# Altium project Fußplatte.PrjPcb
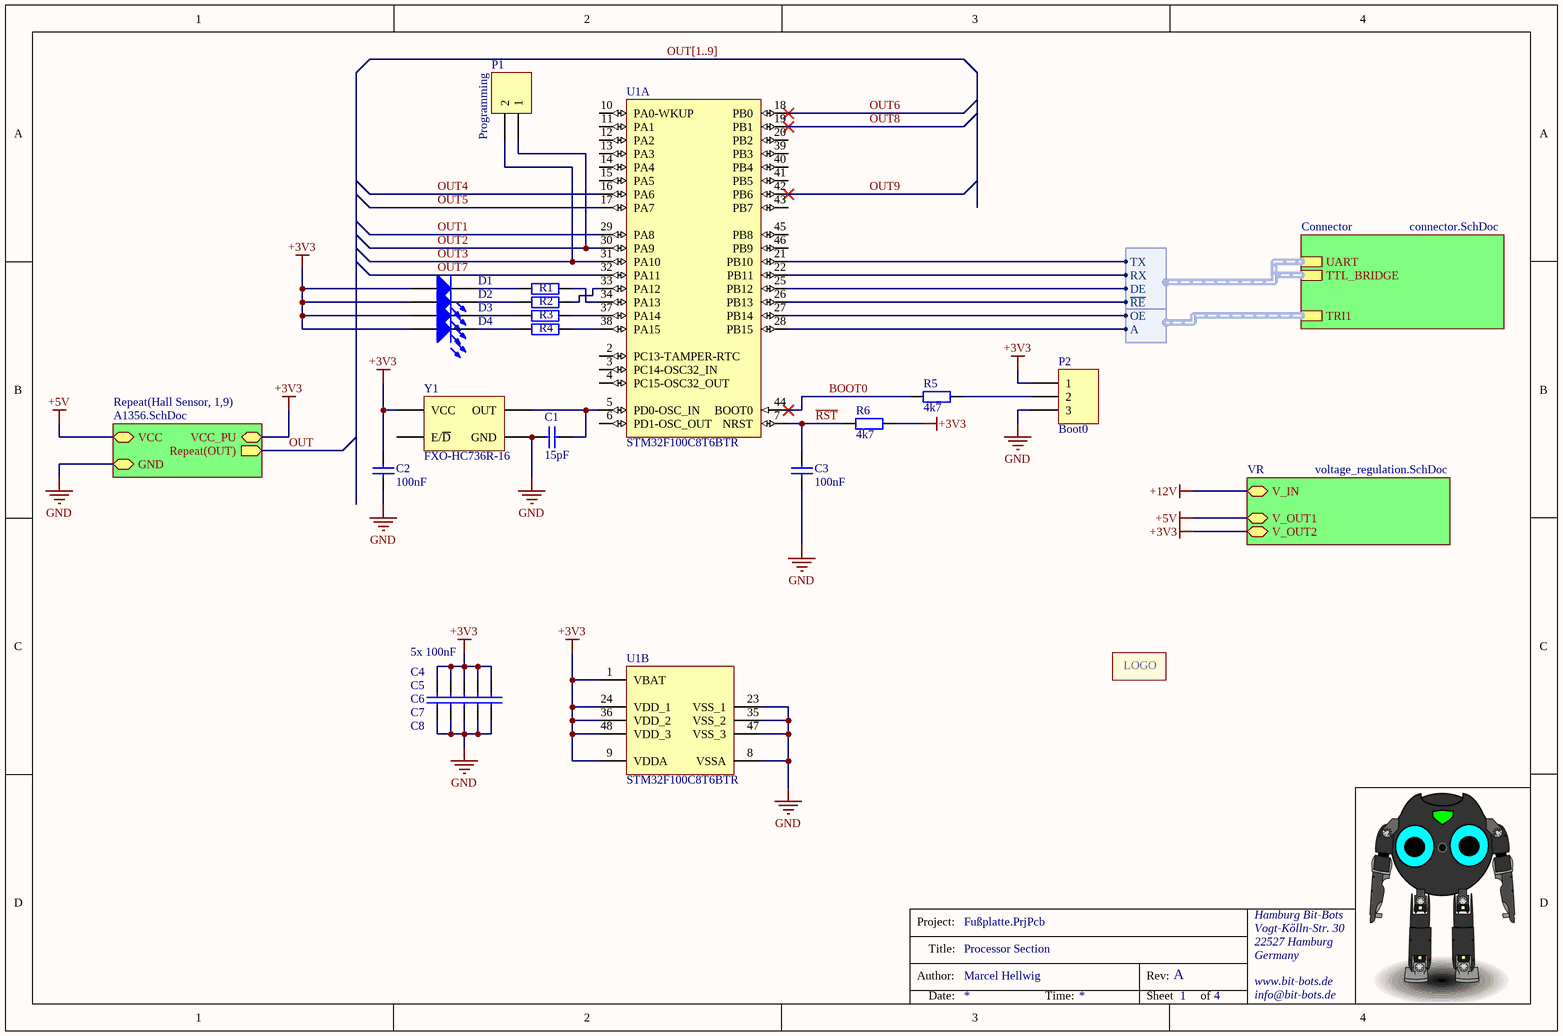
[diagram p0: mainsheet.SchDoc]
ProjectRevision: A
4 sheets, 55 parts. Net scope: hierarchical (ports join the sheet entries above them; power ports are global).
Board files: foot_left.PcbDoc, foot_right.PcbDoc, panelized.PcbDoc
Sheets:
  mainsheet.SchDoc
    Hall Sensor1 = A1356.SchDoc
    Hall Sensor2 = A1356.SchDoc
    Hall Sensor3 = A1356.SchDoc
    Hall Sensor4 = A1356.SchDoc
    Hall Sensor5 = A1356.SchDoc
    Hall Sensor6 = A1356.SchDoc
    Hall Sensor7 = A1356.SchDoc
    Hall Sensor8 = A1356.SchDoc
    Hall Sensor9 = A1356.SchDoc
    Connector = connector.SchDoc
    VR = voltage_regulation.SchDoc

## Sheet mainsheet.SchDoc: Processor Section
size A4; Author: Marcel Hellwig; Organization: Hamburg Bit-Bots; Address1: Vogt-Kölln-Str. 30; Address2: 22527 Hamburg; Address3: Germany; Address4: www.bit-bots.de; DocumentNumber: 1; SheetNumber: 1; SheetTotal: 4; EMail: info@bit-bots.de

### Parts
C1  15pF  [C2012]
C2  100nF  [C2012]
C3  100nF  [C2012]
C4  100nF  [C2012]  (value not drawn)
C5  100nF  [C2012]  (value not drawn)
C6  100nF  [C2012]  (value not drawn)
C7  100nF  [C2012]  (value not drawn)
C8  100nF  [C2012]  (value not drawn)
D1  Green  [MLCC2]  (value not drawn)
D2  Green  [MLCC2]  (value not drawn)
D3  Green  [MLCC2]  (value not drawn)
D4  Green  [MLCC2]  (value not drawn)
Logo1  Hamburg Bit-Bots Logo  [Logo]  (value not drawn)  (no BOM)
P1  Programming  [HDR1X2]  (no BOM)
P2  Boot0  [HDR1X3]  (no BOM)
R1  1k  [R2012]  (value not drawn)
R2  1k  [R2012]  (value not drawn)
R3  1k  [R2012]  (value not drawn)
R4  1k  [R2012]  (value not drawn)
R5  4k7  [R2012]
R6  4k7  [R2012]
U1  STM32F100C8T6BTR  [STM-LQFP48_L]  (parts A,B of 2)
Y1  FXO-HC736R-16  [FXO-HC73]

### Sub-sheets
Connector = connector.SchDoc: UART (harness UART), TTL_BRIDGE (harness UART), TRI1 (harness Tri-State)
Repeat(Hall Sensor, 1,9) = A1356.SchDoc: VCC, GND, Repeat(OUT) (out), VCC_PU
VR = voltage_regulation.SchDoc: V_OUT1, V_OUT2, V_IN

### Harnesses
Tri-State: A, OE
UART: ~{RE}, DE, RX, TX

### Nets
+3V3: C2.1 C4.2 C5.2 C6.2 C7.2 C8.2 D1.1(A) D2.1(A) D3.1(A) D4.1(A) P2.1 R6.2 U1.1(VBAT) U1.9(VDDA) U1.24(VDD_1) U1.36(VDD_2) U1.48(VDD_3) Y1.4(VCC) ; sheet Repeat(Hall Sensor, 1,9)/VCC_PU, sheet VR/V_OUT2
+5V: sheet Repeat(Hall Sensor, 1,9)/VCC, sheet VR/V_OUT1
GND: C1.1 C2.2 C3.1 C4.1 C5.1 C6.1 C7.1 C8.1 P2.3 U1.8(VSSA) U1.23(VSS_1) U1.35(VSS_2) U1.47(VSS_3) Y1.2(GND) ; sheet Repeat(Hall Sensor, 1,9)/GND
~{RST}: C3.2 R6.1 U1.7(NRST)
BOOT0: R5.1 U1.44(BOOT0)
OUT: sheet Repeat(Hall Sensor, 1,9)/Repeat(OUT)
OUT1: U1.29(PA8)
OUT2: P1.1 U1.30(PA9)
OUT3: P1.2 U1.31(PA10)
OUT4: U1.16(PA6)
OUT5: U1.17(PA7)
OUT6: U1.18(PB0)
OUT7: U1.32(PA11)
OUT8: U1.19(PB1)
OUT9: U1.42(PB6)
NetC1_2: C1.2 U1.5(PD0-OSC_IN) Y1.3(OUT)
NetD1_2: D1.2(K) R1.2
NetD2_2: D2.2(K) R2.2
NetD3_2: D3.2(K) R3.2
NetD4_2: D4.2(K) R4.2
NetIC1_2: U1.26(PB13) ; sheet Connector/UART.~{RE}
NetP2_2: P2.2 R5.2
NetR1_1: R1.1 U1.34(PA13)
NetR2_1: R2.1 U1.33(PA12)
NetR3_1: R3.1 U1.37(PA14)
NetR4_1: R4.1 U1.38(PA15)
NetTR1_2: U1.22(PB11) ; sheet Connector/UART.RX
NetTR1_4: U1.25(PB12) ; sheet Connector/UART.DE
NetTR1_5: U1.21(PB10) ; sheet Connector/UART.TX
NetU1_27: U1.27(PB14) ; sheet Connector/TRI1.OE
NetU1_28: U1.28(PB15) ; sheet Connector/TRI1.A

Not connected (* = marked no-connect by the designer): U1 2(PC13-TAMPER-RTC) 3(PC14-OSC32_IN) 4(PC15-OSC32_OUT) 6(PD1-OSC_OUT) 10(PA0-WKUP) 11(PA1) 12(PA2) 13(PA3) 14(PA4) 15(PA5) 20(PB2) 39(PB3) 40(PB4) 41(PB5) 43(PB7) 45(PB8) 46(PB9); Y1 1(E/~{D})

### Buses and harness runs
bus OUT[1..9]
harness sheet Connector/TTL_BRIDGE = sheet Connector/UART

### Notes on the sheet
- 5x 100nF
- Project:
- Author:
- Title:
- Rev:
- Date:
- Time:
- Sheet
- of
- (in symbol Logo) LOGO

### Library data of the parts
C1 = Cap: Capacitor; Manufacturer: MULTICOMP; Manufacturer Part Number: MC0805N150J500CT; Produktpalette: Baureihe MC; Kapazität: 15; Kapazitätstoleranz: ±5%; Dielektrikum: C0G / NP0; Nennspannung: 50; Keramikkondensatorgehäuse: 0805 [Metrisch 2012]; Betriebstemperatur, min.: -55; Betriebstemperatur, max.: 125; Verpackung: Gurtabschnitt; SVHC: No SVHC (17-Dec-2014); Betriebstemperatur: -55°C bis +125; Kondensatoranschlüsse: SMD<!--FANDB--><div class="features-and-benefits-container"></div>; Published: 8-Jun-2000; LatestRevisionDate: 17-Jul-2002; LatestRevisionNote: Re-released for DXP Platform.; PackageReference: RAD-0.3; Publisher: Altium Limited; PackageDescription: Radial Cap, Thru-Hole; 2 Leads; 0.3 in Pin Spacing; Value: 15pF; Supplier 1: Farnell; Supplier Part Number 1: 1759193; RoHS: YES; Stock 1: 38433; Pricing 1: 10=0,021, 100=0,017, 500=0,014, 1000=0,012, 2000=0,009 (EUR); MSL: -; Bauform: 0805 [Metrisch 2012]; Kapazitätstoleranz ±: ±5%; ComponentLink1URL: http://www.farnell.com/datasheets/1870456.pdf; ComponentLink1Description: http://www.farnell.com/datasheets/1870456.pdf
C2-C8 = Cap: Capacitor; Published: 8-Jun-2000; LatestRevisionDate: 17-Jul-2002; LatestRevisionNote: Re-released for DXP Platform.; PackageReference: RAD-0.3; Publisher: Altium Limited; PackageDescription: Radial Cap, Thru-Hole; 2 Leads; 0.3 in Pin Spacing; Value: 100nF
  C2: Supplier 1: Farnell; Supplier Part Number 1: 1759265
D1-D4 = LED0: Typical INFRARED GaAs LED; Manufacturer: VISHAY; Manufacturer Part Number: VLMC3100-GS08; Leuchtengröße: 2.4; LED-Farbe: Grün; Lichtstärke: 1.6; Abstrahlwinkel: 120°; Durchlassstrom If: 2; Durchlassspannung: 1.9; LED-Montage: Oberflächenmontage; Linsenform: Rund; Wellenlänge, typ.: 575; Verpackung: Gurtabschnitt; SVHC: No SVHC (16-Jun-2014); Betriebstemperatur: -40°C bis +100; Betriebstemperatur, max.: 100; Betriebstemperatur, min.: -40; LED-Typ: Standard; LED/Lampen Größe: PLCC-2; Montage: SMD; Sperrspannung: 6; Spitzenwellenlänge: 565; Winkel halber Empfindlichkeit ±: 60; Published: 8-Jun-2000; LatestRevisionDate: 08-Jul-2005; LatestRevisionNote: Mech Layer 1 removed.; PackageReference: LED-0; Publisher: Altium Limited; PackageDescription: LED; 2 Leads; Supplier 1: Farnell; Supplier Part Number 1: 1659076; RoHS: YES; Stock 1: 12975; Pricing 1: 5=0,105, 25=0,0998, 100=0,0952, 250=0,0917, 500=0,0865, 2000=0,0771, 4000=0,0717, 20000=0,0689 (EUR); MSL: MSL 2A - 4 Wochen; Anzahl der Pins: 2; Dominante Wellenlänge: 575; Durchlassspannung Vf max.: 2.4; Durchlassstrom If, max.: 2; Lichtstärke, typ.: 1.6; ComponentLink1URL: http://www.farnell.com/datasheets/1698102.pdf; ComponentLink1Description: http://www.farnell.com/datasheets/1698102.pdf
Logo1 = Logo
P1 = Header 2: Header, 2-Pin; LatestRevisionDate: 17-Jul-2002; LatestRevisionNote: Re-released for DXP Platform.; Publisher: Altium Limited
P2 = Header 3: Header, 3-Pin; LatestRevisionDate: 17-Jul-2002; LatestRevisionNote: Re-released for DXP Platform.; Publisher: Altium Limited
R1-R4 = Res2: Resistor; Manufacturer: MULTICOMP; Manufacturer Part Number: MC01W0805110K; Published: 8-Jun-2000; LatestRevisionDate: 17-Jul-2002; LatestRevisionNote: Re-released for DXP Platform.; PackageReference: AXIAL-0.4; Publisher: Altium Limited; PackageDescription: Axial Device, Thru-Hole; 2 Leads; 0.4 in Pin Spacing; Value: 1k; Supplier 1: Farnell; Supplier Part Number 1: 9332391; RoHS: Y-EX; Stock 1: 4370; Pricing 1: 50=0,038, 250=0,031, 1000=0,022, 5000=0,014, 15000=0,009 (EUR); ComponentLink1URL: http://www.farnell.com/datasheets/1729047.pdf; ComponentLink1Description: http://www.farnell.com/datasheets/1729047.pdf; ComponentLink2URL: http://www.farnell.com/cad/1561156.zip; ComponentLink2Description: http://www.farnell.com/cad/1561156.zip
R5 R6 = Res2: Resistor; Published: 8-Jun-2000; LatestRevisionDate: 17-Jul-2002; LatestRevisionNote: Re-released for DXP Platform.; PackageReference: AXIAL-0.4; Publisher: Altium Limited; PackageDescription: Axial Device, Thru-Hole; 2 Leads; 0.4 in Pin Spacing; Value: 4k7
U1 = CMP-0237-00141-3: ARM Cortex-M3 32-bit MCU, 64 KB Flash, 8 KB Internal RAM, 37 I/Os, 48-pin LQFP, -40 to 85 degC, Tape and Reel; D/A Converter: 2x12-bit (2 Channel); I/Os (High Current): 37; A/D Converter: 1x12-bit (10 Channel); FLASH Size (Prog) (kB): 64; Operating Frequency(F) (Processor speed) (MHz): 24; Internal RAM Size (kB): 8; Supply Voltage(Vcc) min (V): 2; ComponentLink2Description: Datasheet; ComponentLink3Description: Package Specification; Packing: Tape and Reel; Core: ARM Cortex-M3; DatasheetVersion: Rev. 7; Mounting Technology: Surface Mount; ComponentLink3URL: http://www.st.com/st-web-ui/static/active/en/resource/technical/document/datasheet/DM00058181.pdf; PackageVersion: Rev. 6, 06/2013; PackageReference: LQFP48; ComponentLink1Description: Manufacturer URL; PartNumber: STM32F100C8T6BTR; ComponentLink1URL: http://www.st.com/web/en/home.html; PackageDescription: 48-Pin Low Profile Quad Flat Package, 7 x 7 mm Body, 0.5 mm Pitch; ComponentLink2URL: http://www.st.com/st-web-ui/static/active/en/resource/technical/document/datasheet/CD00251732.pdf; PartId: 1
Y1 = Oszillator: Oscillator with Enable Input; Supplier 1: Farnell; Supplier Part Number 1: 1640997

## Sheet A1356.SchDoc: Hall Sensor
size A4; Author: Marcel Hellwig; Organization: Hamburg Bit-Bots; Address1: Vogt-Kölln-Str. 30; Address2: 22527 Hamburg; Address3: Germany; Address4: www.bit-bots.de; DocumentNumber: 3; SheetNumber: 3; SheetTotal: 4; EMail: info@bit-bots.de
Used 9 times, as channels Hall Sensor1, Hall Sensor2, Hall Sensor3, Hall Sensor4, Hall Sensor5, Hall Sensor6, Hall Sensor7, Hall Sensor8, Hall Sensor9. Parts and nets are listed once, with the designators drawn on the sheet.
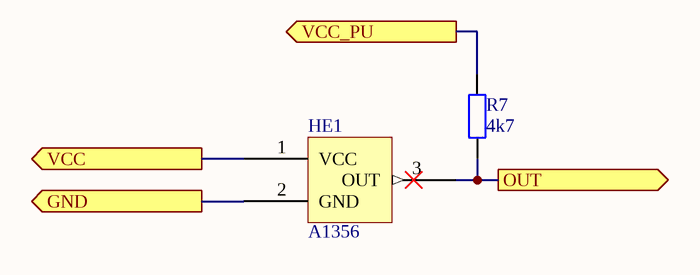
[diagram p1: A1356.SchDoc]

### Parts
HE1  A1356  [3-Pin SIP]
R7  4k7  [R2012]

### Ports
GND, OUT (out), VCC, VCC_PU

### Nets
GND: HE1.2(GND) ; port GND
OUT: HE1.3(OUT) R7.1 ; port OUT
VCC: HE1.1(VCC) ; port VCC
VCC_PU: R7.2 ; port VCC_PU

### Channels
Hall Sensor1: designators end in _1; ports GND=GND OUT=OUT1 VCC=+5V VCC_PU=+3V3
Hall Sensor2: designators end in _2; ports GND=GND OUT=OUT2 VCC=+5V VCC_PU=+3V3
Hall Sensor3: designators end in _3; ports GND=GND OUT=OUT3 VCC=+5V VCC_PU=+3V3
Hall Sensor4: designators end in _4; ports GND=GND OUT=OUT4 VCC=+5V VCC_PU=+3V3
Hall Sensor5: designators end in _5; ports GND=GND OUT=OUT5 VCC=+5V VCC_PU=+3V3
Hall Sensor6: designators end in _6; ports GND=GND OUT=OUT6 VCC=+5V VCC_PU=+3V3
Hall Sensor7: designators end in _7; ports GND=GND OUT=OUT7 VCC=+5V VCC_PU=+3V3
Hall Sensor8: designators end in _8; ports GND=GND OUT=OUT8 VCC=+5V VCC_PU=+3V3
Hall Sensor9: designators end in _9; ports GND=GND OUT=OUT9 VCC=+5V VCC_PU=+3V3

### Notes on the sheet
- Project:
- Author:
- Title:
- Rev:
- Date:
- Time:
- Sheet
- of

### Library data of the parts
HE1 = A1356: Linear Hall-Effect Sensor
R7 = Res2: Resistor; Published: 8-Jun-2000; LatestRevisionDate: 17-Jul-2002; LatestRevisionNote: Re-released for DXP Platform.; PackageReference: AXIAL-0.4; Publisher: Altium Limited; PackageDescription: Axial Device, Thru-Hole; 2 Leads; 0.4 in Pin Spacing; Value: 4k7

## Sheet connector.SchDoc: Communication Section
size A4; Author: Marcel Hellwig; Organization: Hamburg Bit-Bots; Address1: Vogt-Kölln-Str. 30; Address2: 22527 Hamburg; Address3: Germany; Address4: www.bit-bots.de; DocumentNumber: 2; SheetNumber: 2; SheetTotal: 4; EMail: info@bit-bots.de
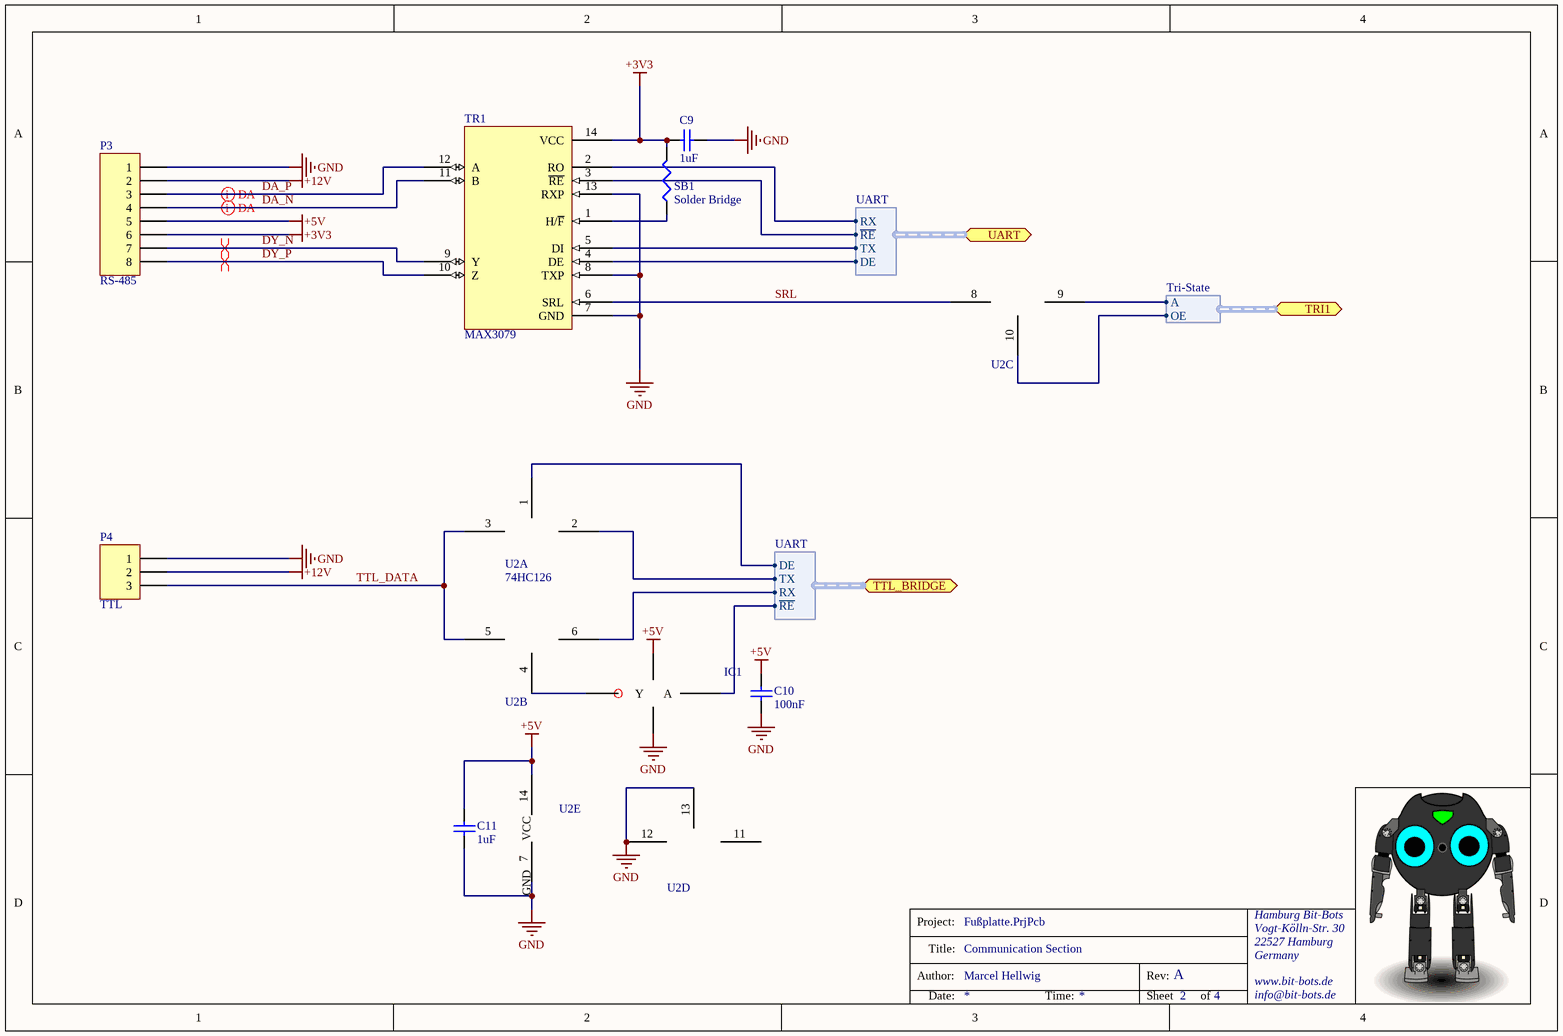
[diagram p2: connector.SchDoc]

### Parts
C9  1uF  [C2012]
C10  100nF  [C2012]
C11  1uF  [C2012]
IC1  74AHC1G04  [SOT-353]  (value not drawn)
P3  RS-485  [8-Pin]
P4  TTL  [3-Pin]
SB1  Solder Bridge  [J1-0603]  (no BOM)
TR1  MAX3079  [SOIC14]
U2  74HC126  [SOIC14]  (parts A,B,C,D,E of 5)

### Ports
TRI1 (harness Tri-State), TTL_BRIDGE (harness UART), UART (harness UART)

### Harnesses
UART: ~{RE}, DE, RX, TX
Tri-State: A, OE

### Nets
+3V3: C9.1 P3.6 SB1.2 TR1.14(VCC)
+5V: C10.2 C11.1 IC1.5(VCC) P3.5 U2.14(VCC)
+12V: P3.2 P4.2
GND: C9.2 C10.1 C11.2 IC1.3(GND) P3.1 P4.1 TR1.7(GND) TR1.8(TXP) TR1.13(RXP) U2.7(GND) U2.12(A4) U2.13(OE4)
DA_N: P3.4 TR1.11(B)
DA_P: P3.3 TR1.12(A)
DY_N: P3.7 TR1.9(Y)
DY_P: P3.8 TR1.10(Z)
SRL: TR1.6(SRL) U2.8(Y3)
TTL_DATA: P4.3 U2.3(Y1) U2.5(A2)
NetIC1_2: IC1.2(A) TR1.3(~{RE}) ; port UART.~{RE}
NetIC1_4: IC1.4(Y) U2.4(OE2)
NetSB1_1: SB1.1 TR1.1(H/~{F})
NetTR1_2: TR1.2(RO) U2.6(Y2) ; port UART.RX
NetTR1_4: TR1.4(DE) U2.1(OE1) ; port UART.DE
NetTR1_5: TR1.5(DI) U2.2(A1) ; port UART.TX
NetU1_27: U2.10(OE3) ; port TRI1.OE
NetU1_28: U2.9(A3) ; port TRI1.A

Not connected (* = marked no-connect by the designer): U2 11(Y4)

### Layout directives
differential pair: DA_N, DA_P, DY_N, DY_P

### Notes on the sheet
- Project:
- Author:
- Title:
- Rev:
- Date:
- Time:
- Sheet
- of

### Library data of the parts
C9 = Cap Semi: Capacitor; Published: 8-Jun-2000; LatestRevisionDate: 29-May-2009; LatestRevisionNote: IPC-7351 Footprint Added.; PackageReference: C1206; Publisher: Altium Limited; PackageDescription: Chip Capacitor; Value: 1uF
C10 = Cap: Capacitor; Published: 8-Jun-2000; LatestRevisionDate: 17-Jul-2002; LatestRevisionNote: Re-released for DXP Platform.; PackageReference: RAD-0.3; Publisher: Altium Limited; PackageDescription: Radial Cap, Thru-Hole; 2 Leads; 0.3 in Pin Spacing; Value: 100nF
C11 = Cap: Capacitor; Manufacturer: MULTICOMP; Manufacturer Part Number: MC0805B105K250CT; Produktpalette: Baureihe MC; Kapazität: 1; Kapazitätstoleranz: ±10%; Dielektrikum: X7; Nennspannung: 25; Keramikkondensatorgehäuse: 0805 [Metrisch 2012]; Betriebstemperatur, min.: -55; Betriebstemperatur, max.: 125; Verpackung: Gurtabschnitt; Kondensatoranschlüsse: SMD<!--FANDB--><div class="features-and-benefits-container"></div>; Published: 8-Jun-2000; LatestRevisionDate: 17-Jul-2002; LatestRevisionNote: Re-released for DXP Platform.; PackageReference: RAD-0.3; Publisher: Altium Limited; PackageDescription: Radial Cap, Thru-Hole; 2 Leads; 0.3 in Pin Spacing; Value: 1uF; Supplier 1: Farnell; Supplier Part Number 1: 2320827; RoHS: YES; Stock 1: 4031; Pricing 1: 10=0,06, 100=0,05, 500=0,041, 1000=0,034, 1500=0,027 (EUR); MSL: MSL 1 - unbegrenzt; Bauform: 0805 [Metrisch 2012]; Kapazitätstoleranz ±: ±10%; ComponentLink1URL: http://www.farnell.com/datasheets/1870456.pdf; ComponentLink1Description: http://www.farnell.com/datasheets/1870456.pdf
IC1 = 74AHC1G04: Single Logic Inverter; Supplier 1: Farnell; Supplier Part Number 1: 1085239
P3 = Header 8: Header, 8-Pin; LatestRevisionDate: 17-Jul-2002; LatestRevisionNote: Re-released for DXP Platform.; Publisher: Altium Limited
P4 = Header 3: Header, 3-Pin; LatestRevisionDate: 17-Jul-2002; LatestRevisionNote: Re-released for DXP Platform.; Publisher: Altium Limited
SB1 = Res3: Resistor; Value: 1K; Published: 8-Jun-2000; LatestRevisionDate: 29-May-2009; LatestRevisionNote: IPC-7351 Footprint Added.; PackageReference: J1-0603; Publisher: Altium Limited; PackageDescription: Chip Resistor
TR1 = MAX3079: MAX3079 RS485-Transreceiver; Supplier 1: Farnell
U2 = 74HC126: Quad 3-State Noninverting Buffer; Manufacturer: NXP; Manufacturer Part Number: 74HC126D; Supplier 1: Farnell; Supplier Part Number 1: 1085233; RoHS: YES; Stock 1: 198; Pricing 1: 1=0,444, 10=0,311, 100=0,214, 200=0,193, 500=0,173, 2000=0,155, 5000=0,0826, 20000=0,0733 (EUR); ComponentLink1URL: http://www.farnell.com/datasheets/1852048.pdf; ComponentLink1Description: http://www.farnell.com/datasheets/1852048.pdf; ComponentLink2URL: http://www.farnell.com/cad/1638396.zip; ComponentLink2Description: http://www.farnell.com/cad/1638396.zip

## Sheet voltage_regulation.SchDoc: Voltage Regulation
size A4; Author: Marcel Hellwig; Organization: Hamburg Bit-Bots; Address1: Vogt-Kölln-Str. 30; Address2: 22527 Hamburg; Address3: Germany; Address4: www.bit-bots.de; DocumentNumber: 4; SheetNumber: 4; SheetTotal: 4; EMail: info@bit-bots.de
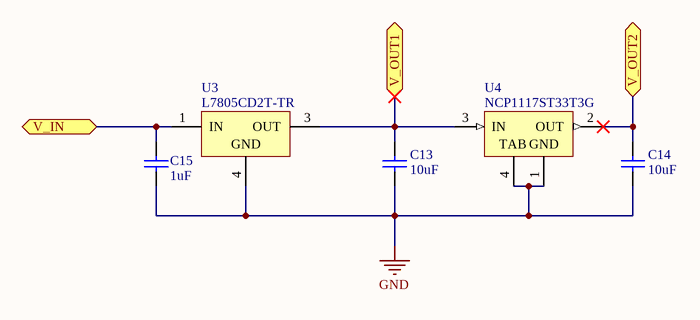
[diagram p3: voltage_regulation.SchDoc]

### Parts
C13  10uF  [C2012]
C14  10uF  [C2012]
C15  1uF  [C2012]
U3  L7805CD2T-TR  [TO-263_M]
U4  NCP1117ST33T3G  [ONSC-SOT-223_L]

### Ports
V_IN, V_OUT1, V_OUT2

### Nets
+3V3: C14.2 U4.2(OUT) ; port V_OUT2
+5V: C13.2 U3.3(OUT) U4.3(IN) ; port V_OUT1
+12V: C15.1 U3.1(IN) ; port V_IN
GND: C13.1 C14.1 C15.2 U3.4(GND) U4.1(GND) U4.4(TAB)

### Notes on the sheet
- Project:
- Author:
- Title:
- Rev:
- Date:
- Time:
- Sheet
- of

### Library data of the parts
C13 C14 = Cap: Capacitor; Manufacturer: MULTICOMP; Manufacturer Part Number: MC0805X106K250CT; Produktpalette: Baureihe MC; Kapazität: 10; Kapazitätstoleranz: ±10%; Dielektrikum: X5; Nennspannung: 25; Keramikkondensatorgehäuse: 0805 [Metrisch 2012]; Betriebstemperatur, min.: -55; Betriebstemperatur, max.: 85; Verpackung: Gurtabschnitt; Kondensatoranschlüsse: SMD<!--FANDB--><div class="features-and-benefits-container"></div>; Published: 8-Jun-2000; LatestRevisionDate: 17-Jul-2002; LatestRevisionNote: Re-released for DXP Platform.; PackageReference: RAD-0.3; Publisher: Altium Limited; PackageDescription: Radial Cap, Thru-Hole; 2 Leads; 0.3 in Pin Spacing; Value: 10uF; Supplier 1: Farnell; Supplier Part Number 1: 2320833; RoHS: YES; Stock 1: 46180; Pricing 1: 10=0,147, 100=0,121, 500=0,1, 1000=0,083, 1500=0,066 (EUR); MSL: MSL 1 - unbegrenzt; Bauform: 0805 [Metrisch 2012]; Kapazitätstoleranz ±: ±10%; ComponentLink1URL: http://www.farnell.com/datasheets/1870456.pdf; ComponentLink1Description: http://www.farnell.com/datasheets/1870456.pdf
C15 = Cap: as C11 on sheet connector; Published: 8-Jun-2000; LatestRevisionDate: 17-Jul-2002; LatestRevisionNote: Re-released for DXP Platform.; PackageReference: RAD-0.3; Publisher: Altium Limited; PackageDescription: Radial Cap, Thru-Hole; 2 Leads; 0.3 in Pin Spacing; Value: 1uF; Supplier 1: Farnell; Supplier Part Number 1: 2320827; RoHS: YES; Stock 1: 4031; Pricing 1: 10=0,06, 100=0,05, 500=0,041, 1000=0,034, 1500=0,027 (EUR); MSL: MSL 1 - unbegrenzt; Bauform: 0805 [Metrisch 2012]; Kapazitätstoleranz ±: ±10%; ComponentLink1URL: http://www.farnell.com/datasheets/1870456.pdf; ComponentLink1Description: http://www.farnell.com/datasheets/1870456.pdf
U3 = CMP-0244-00213-1: Positive Voltage Regulator, 3-Pin D2PAK, Tape and Reel; PackageReference: TO-263; ComponentLink2URL: http://www.st.com/internet/com/TECHNICAL_RESOURCES/TECHNICAL_LITERATURE/DATASHEET/CD00000444.pdf; PackageDescription: 3-Pin Transistor Outline Package 2.54 mm Pitch, 15.4 mm Lead Span (D2PAK); DatasheetVersion: 16/11/2011; ComponentLink2Description: Datasheet; ComponentLink1Description: Manufacturer URL; PackageVersion: 2011; ComponentLink1URL: http://www.st.com; Supplier 1: Farnell; Supplier Part Number 1: 1366576
U4 = CMP-0592-00001-2: 1.0 A Low-Dropout Positive Fixed Voltage Regulator, 5 V Vout, 0 to 125 degC, 4-Pin SOT-223, Pb-Free, Tape and Reel; PartNumber: NCP1117ST50T3G; Manufacturer: ON Semiconductor; IQ: 6 mA; Iout (Min): 1 A; Nominal Output Voltage: 3.3 V; Vin: 20 V; RR: 61 dB; Dropout Voltage: 1.2 V; Packing: Tape and Reel; DatasheetVersion: Rev. 26; ComponentLink3URL: http://www.onsemi.com/pub_link/Collateral/318H-01.PDF; ComponentLink2URL: http://www.onsemi.com/pub_link/Collateral/NCP1117-D.PDF; Mounting Technology: Surface Mount; ComponentLink2Description: Datasheet; Operating Temperature: 0 to 125 degC; ComponentLink1Description: Manufacturer URL; PackageDescription: 4-Pin Small Out-Line Transistor, Body 3.5 x 6.5 mm, Pitch 2.3 mm; ComponentLink1URL: http://www.onsemi.com/; PackageReference: SOT-223; ComponentLink3Description: Package Specification; Supplier 1: Farnell; Supplier Part Number 1: 1652366

## Nets that join several sheets
+3V3: mainsheet (18 pins), Hall Sensor1 (R7_1.2), Hall Sensor2 (R7_2.2), Hall Sensor3 (R7_3.2), Hall Sensor4 (R7_4.2), Hall Sensor5 (R7_5.2), Hall Sensor6 (R7_6.2), Hall Sensor7 (R7_7.2), Hall Sensor8 (R7_8.2), Hall Sensor9 (R7_9.2), connector (C9.1 P3.6 SB1.2 TR1.14), voltage_regulation (C14.2 U4.2)
+5V: Hall Sensor1 (HE1_1.1), Hall Sensor2 (HE1_2.1), Hall Sensor3 (HE1_3.1), Hall Sensor4 (HE1_4.1), Hall Sensor5 (HE1_5.1), Hall Sensor6 (HE1_6.1), Hall Sensor7 (HE1_7.1), Hall Sensor8 (HE1_8.1), Hall Sensor9 (HE1_9.1), connector (5 pins), voltage_regulation (C13.2 U3.3 U4.3)
+12V: connector (P3.2 P4.2), voltage_regulation (C15.1 U3.1)
GND: mainsheet (14 pins), Hall Sensor1 (HE1_1.2), Hall Sensor2 (HE1_2.2), Hall Sensor3 (HE1_3.2), Hall Sensor4 (HE1_4.2), Hall Sensor5 (HE1_5.2), Hall Sensor6 (HE1_6.2), Hall Sensor7 (HE1_7.2), Hall Sensor8 (HE1_8.2), Hall Sensor9 (HE1_9.2), connector (12 pins), voltage_regulation (6 pins)
NetIC1_2: mainsheet (U1.26), connector (IC1.2 TR1.3)
NetTR1_2: mainsheet (U1.22), connector (TR1.2 U2.6)
NetTR1_4: mainsheet (U1.25), connector (TR1.4 U2.1)
NetTR1_5: mainsheet (U1.21), connector (TR1.5 U2.2)
NetU1_27: mainsheet (U1.27), connector (U2.10)
NetU1_28: mainsheet (U1.28), connector (U2.9)
OUT1: mainsheet (U1.29), Hall Sensor1 (HE1_1.3 R7_1.1)
OUT2: mainsheet (P1.1 U1.30), Hall Sensor2 (HE1_2.3 R7_2.1)
OUT3: mainsheet (P1.2 U1.31), Hall Sensor3 (HE1_3.3 R7_3.1)
OUT4: mainsheet (U1.16), Hall Sensor4 (HE1_4.3 R7_4.1)
OUT5: mainsheet (U1.17), Hall Sensor5 (HE1_5.3 R7_5.1)
OUT6: mainsheet (U1.18), Hall Sensor6 (HE1_6.3 R7_6.1)
OUT7: mainsheet (U1.32), Hall Sensor7 (HE1_7.3 R7_7.1)
OUT8: mainsheet (U1.19), Hall Sensor8 (HE1_8.3 R7_8.1)
OUT9: mainsheet (U1.42), Hall Sensor9 (HE1_9.3 R7_9.1)

## Assembly variants
TTL: not fitted C9 P3 SB1 SB1 TR1
RS-485 HD: not fitted C10 IC1 P4
RS-485 FD: not fitted C10 C13 C14 C15 IC1 P4 SB1 SB? U3 U4